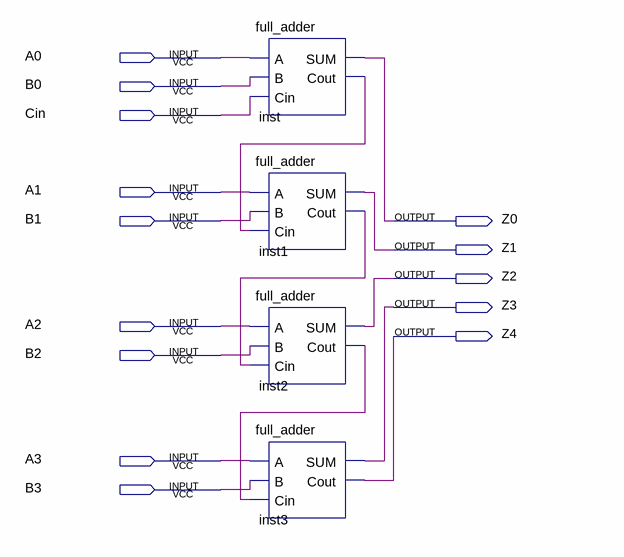
[diagram p0: schematic sheet]
// Quartus schematic lab2.bdf as structural Verilog: 4 symbols, 14 pins
module lab2 (
  input  A0,
  input  B0,
  input  Cin,
  input  A1,
  input  B1,
  input  A2,
  input  B2,
  input  A3,
  input  B3,
  output Z0,
  output Z1,
  output Z2,
  output Z3,
  output Z4
);

  wire inst1_cout, inst2_cout, inst_cout;

  full_adder inst (.A(A0), .B(B0), .Cin(Cin), .SUM(Z0), .Cout(inst_cout));
  full_adder inst1 (.A(A1), .B(B1), .Cin(inst_cout), .SUM(Z1), .Cout(inst1_cout));
  full_adder inst2 (.A(A2), .B(B2), .Cin(inst1_cout), .SUM(Z2), .Cout(inst2_cout));
  full_adder inst3 (.A(A3), .B(B3), .Cin(inst2_cout), .SUM(Z3), .Cout(Z4));
endmodule
